# EAGLE design Mini_VFD_UI_RevA (EAGLE 9.6.2)
AUTH_NAME: MNa; REV_NO: A
Assembly variants: Assembly_1

## Sheet 1 of 3: Concept
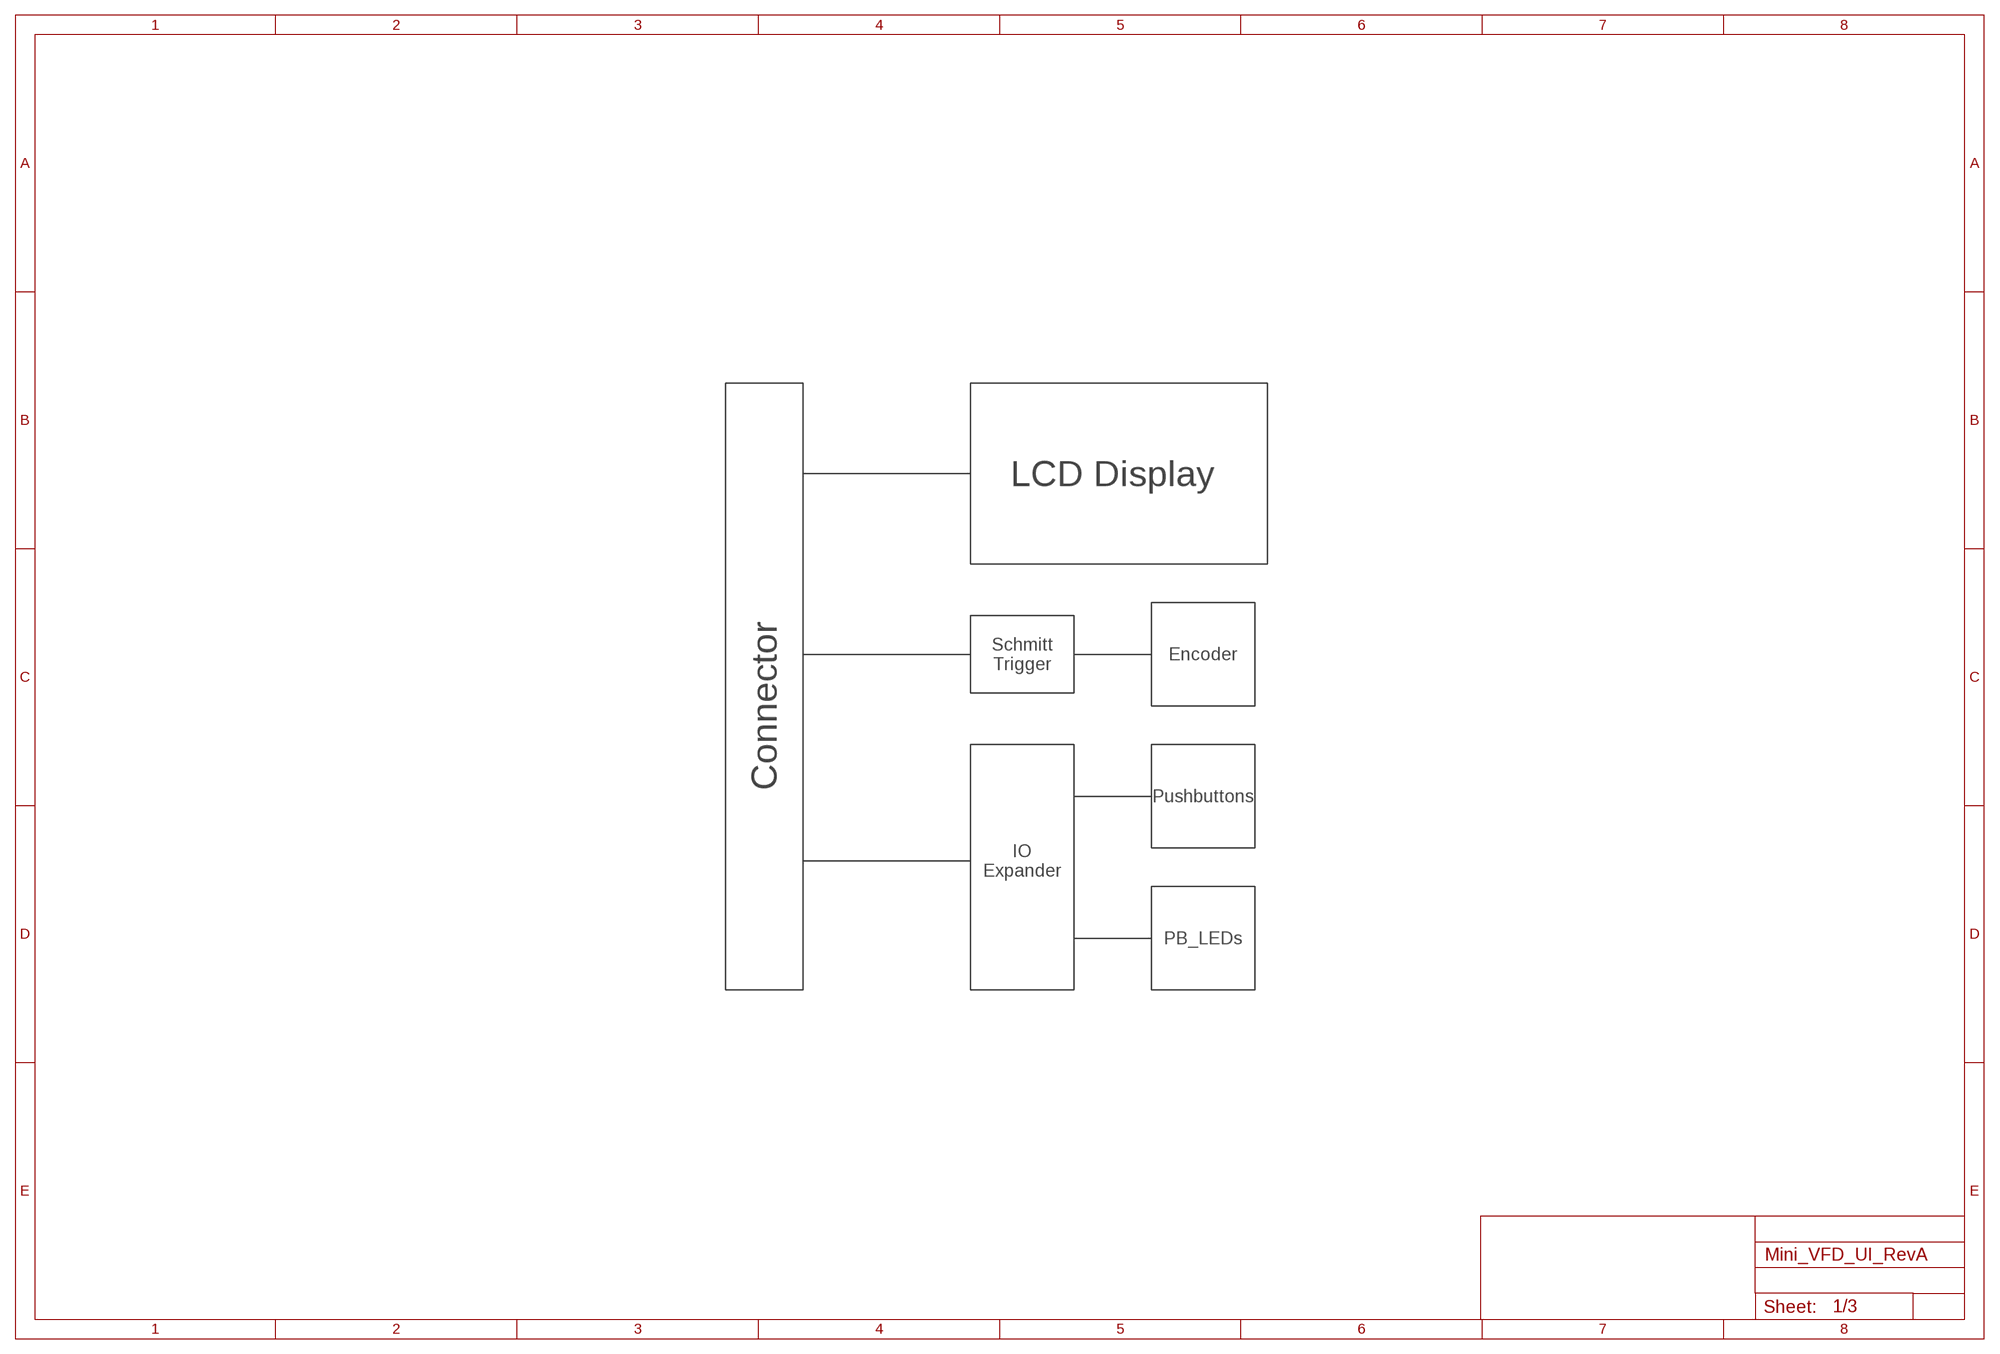
[diagram p0: schematic, sheet 1]

### Notes on the sheet
- LCD Display
- Schmitt
  Trigger
- Encoder
- Connector
- Pushbuttons
- IO
  Expander
- PB_LEDs

## Sheet 2 of 3: Processor
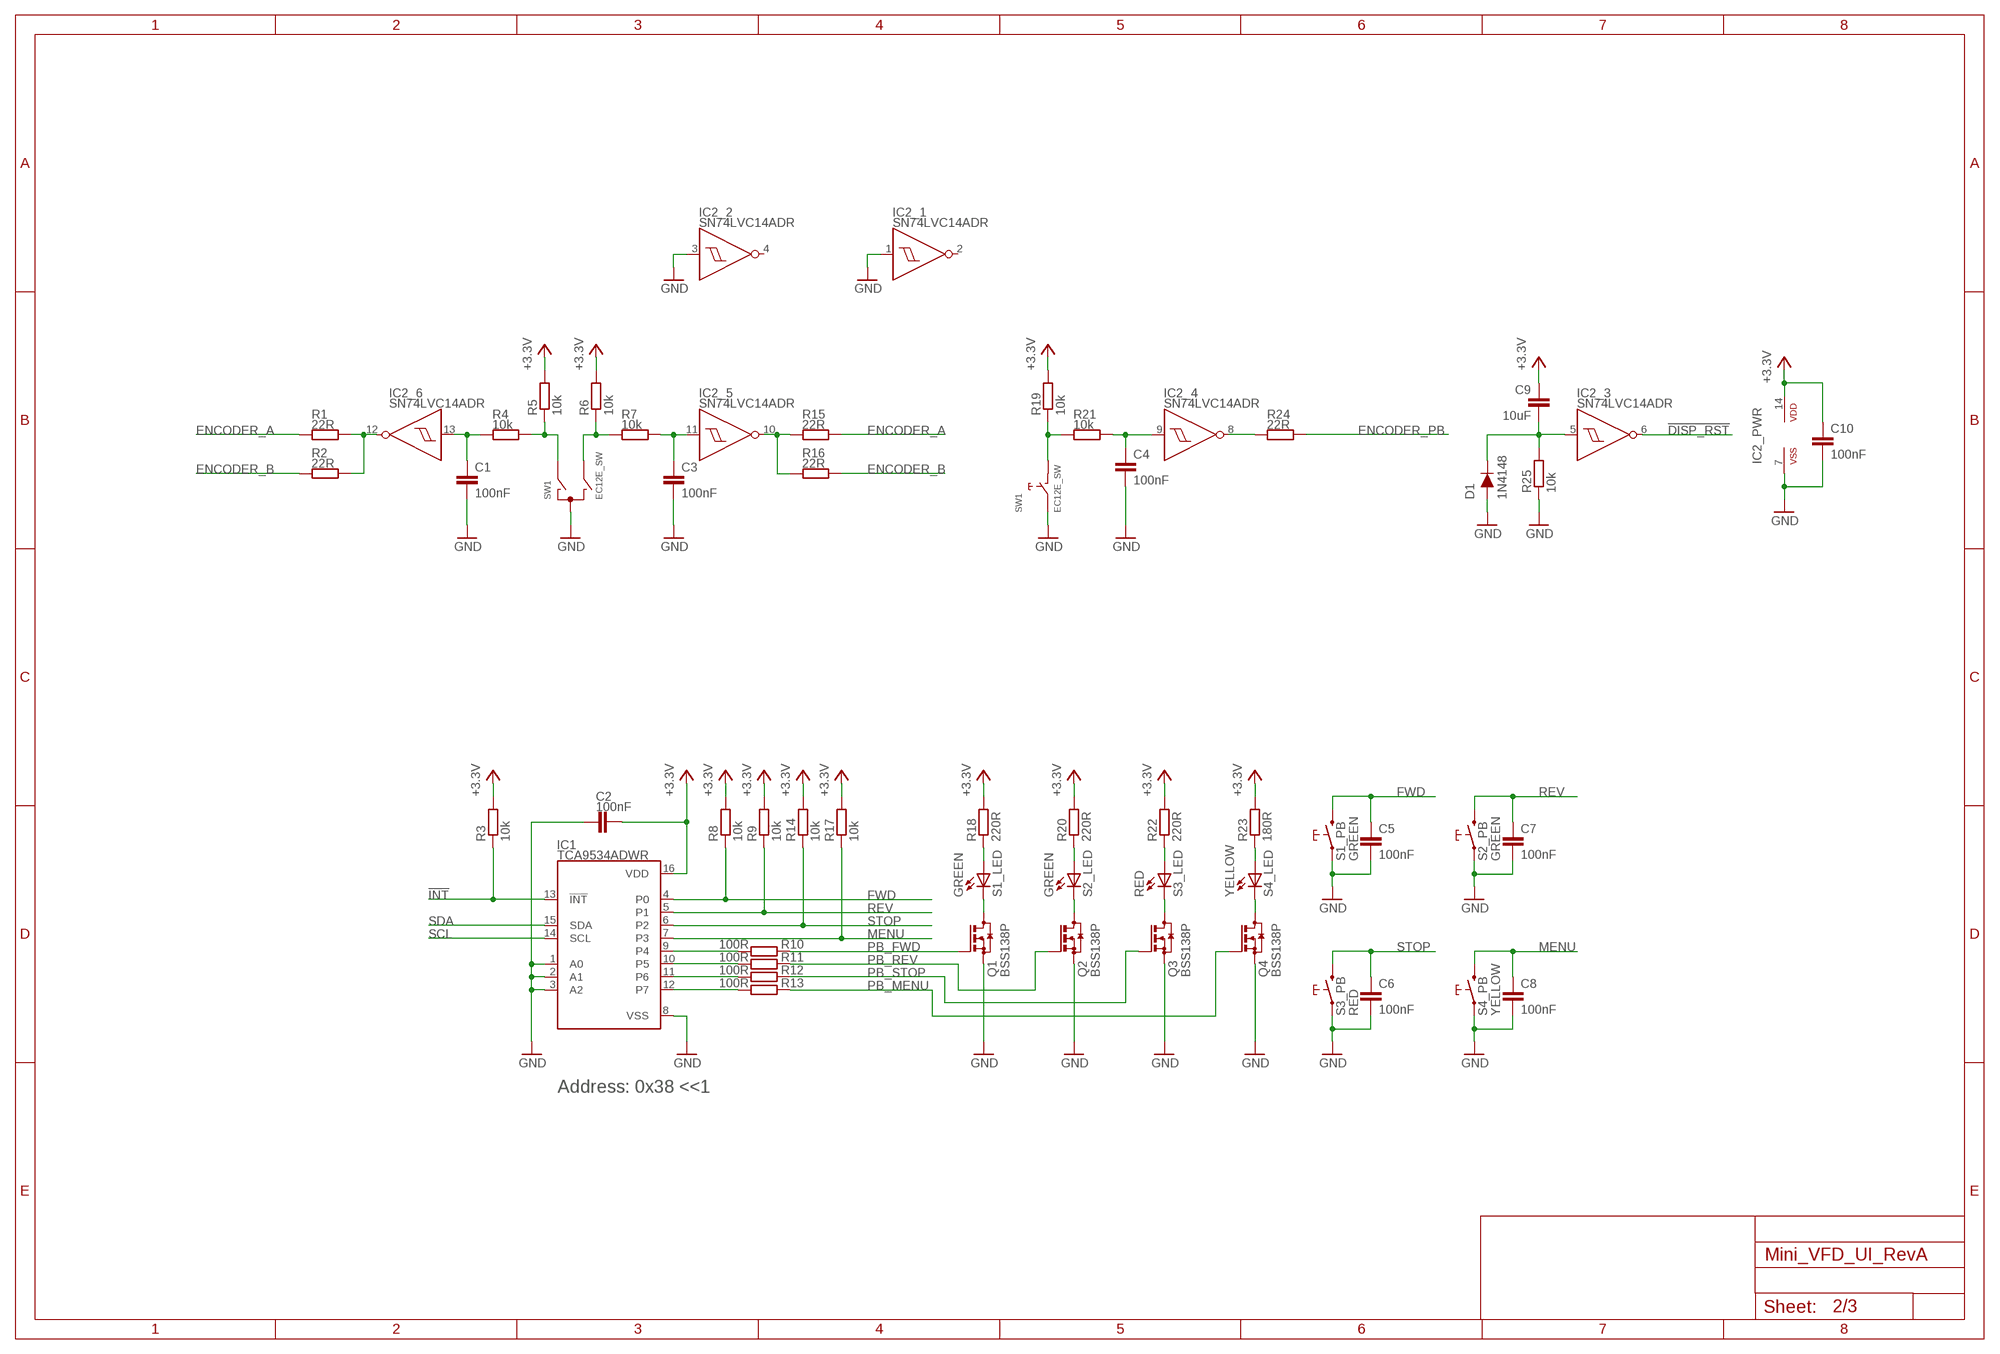
[diagram p1: schematic, sheet 2]

### Parts
C1  100nF  C-EUC0603  [C0603]
C2  100nF  C-EUC0603  [C0603]
C3  100nF  C-EUC0603  [C0603]
C4  100nF  C-EUC0603  [C0603]
C5  100nF  C-EUC0603  [C0603]
C6  100nF  C-EUC0603  [C0603]
C7  100nF  C-EUC0603  [C0603]
C8  100nF  C-EUC0603  [C0603]
C9  10uF  C-EUC1206  [C1206]
C10  100nF  C-EUC0603  [C0603]
D1  1N4148  DIODE  [SOD123]
IC1  TCA9534ADWR  TCA9534APWR_SOIC  [SOIC16R]
IC2  SN74LVC14ADR  SN74AC14PWR_SOIC  [SO14]
Q1  BSS138P  NMOS_BSS138P  [SOT23]
Q2  BSS138P  NMOS_BSS138P  [SOT23]
Q3  BSS138P  NMOS_BSS138P  [SOT23]
Q4  BSS138P  NMOS_BSS138P  [SOT23]
R1  22R  R-EU_R0603  [R0603]  (not fitted in variant Assembly_1)
R2  22R  R-EU_R0603  [R0603]
R3  10k  R-EU_R0603  [R0603]
R4  10k  R-EU_R0603  [R0603]
R5  10k  R-EU_R0603  [R0603]
R6  10k  R-EU_R0603  [R0603]
R7  10k  R-EU_R0603  [R0603]
R8  10k  R-EU_R0603  [R0603]
R9  10k  R-EU_R0603  [R0603]
R10  100R  R-EU_R0603  [R0603]
R11  100R  R-EU_R0603  [R0603]
R12  100R  R-EU_R0603  [R0603]
R13  100R  R-EU_R0603  [R0603]
R14  10k  R-EU_R0603  [R0603]
R15  22R  R-EU_R0603  [R0603]
R16  22R  R-EU_R0603  [R0603]  (not fitted in variant Assembly_1)
R17  10k  R-EU_R0603  [R0603]
R18  220R  R-EU_R0603  [R0603]
R19  10k  R-EU_R0603  [R0603]
R20  220R  R-EU_R0603  [R0603]
R21  10k  R-EU_R0603  [R0603]
R22  220R  R-EU_R0603  [R0603]
R23  180R  R-EU_R0603  [R0603]
R24  22R  R-EU_R0603  [R0603]
R25  10k  R-EU_R0603  [R0603]
S1  GREEN  PUSHBUTTON  [PB_ALIEXPRESS]
S2  GREEN  PUSHBUTTON  [PB_ALIEXPRESS]
S3  RED  PUSHBUTTON  [PB_ALIEXPRESS]
S4  YELLOW  PUSHBUTTON  [PB_ALIEXPRESS]
SW1  EC12E_SW  [ALPS_EC12E_SW]

### Nets
!DISP_RST: IC2.6(_3:O) ; also sheet 3
!INT: IC1.13(!INT) R3.1 ; also sheet 3
+3.3V: C2.2 C9.1 C10.1 IC1.16(VDD) IC2.14(_PWR:VDD) R3.2 R5.2 R6.2 R8.2 R9.2 R14.2 R17.2 R18.2 R19.2 R20.2 R22.2 R23.2 ; also sheet 3
ENCODER_A: R1.1 R15.2 ; also sheet 3
ENCODER_B: R2.1 R16.2 ; also sheet 3
ENCODER_PB: R24.2 ; also sheet 3
FWD: C5.1 IC1.4(P0) R8.1 S1.2A S1.2B
GND: C1.2 C2.1 C3.2 C4.2 C5.2 C6.2 C7.2 C8.2 C10.2 D1.2(A) IC1.1(A0) IC1.2(A1) IC1.3(A2) IC1.8(VSS) IC2.1(_1:I) IC2.3(_2:I) IC2.7(_PWR:VSS) Q1.2(S) Q2.2(S) Q3.2(S) Q4.2(S) R25.1 S1.1A S1.1B S2.1A S2.1B S3.1A S3.1B S4.1A S4.1B SW1.C SW1.E ; also sheet 3
MENU: C8.1 IC1.7(P3) R17.1 S4.2A S4.2B
N$1: R4.2 R5.1 SW1.A
N$2: R6.1 R7.1 SW1.B
N$3: C1.1 IC2.13(_6:I) R4.1
N$4: C3.1 IC2.11(_5:I) R7.2
N$5: R19.1 R21.1 SW1.D
N$6: C4.1 IC2.9(_4:I) R21.2
N$7: IC2.10(_5:O) R15.1 R16.1
N$8: IC2.12(_6:O) R1.2 R2.2
N$9: C9.2 D1.1(C) IC2.5(_3:I) R25.2
N$10: IC1.12(P7) R13.1
N$11: IC1.11(P6) R12.1
N$12: IC1.10(P5) R11.1
N$13: IC1.9(P4) R10.1
N$18: Q1.3(D) S1.-(_LED:C)
N$19: Q2.3(D) S2.-(_LED:C)
N$20: Q3.3(D) S3.-(_LED:C)
N$21: Q4.3(D) S4.-(_LED:C)
N$22: R18.1 S1.+(_LED:A)
N$23: R20.1 S2.+(_LED:A)
N$24: R22.1 S3.+(_LED:A)
N$25: R23.1 S4.+(_LED:A)
N$34: IC2.8(_4:O) R24.1
PB_FWD: Q1.1(G) R10.2
PB_MENU: Q4.1(G) R13.2
PB_REV: Q2.1(G) R11.2
PB_STOP: Q3.1(G) R12.2
REV: C7.1 IC1.5(P1) R9.1 S2.2A S2.2B
SCL: IC1.14(SCL) ; also sheet 3
SDA: IC1.15(SDA) ; also sheet 3
STOP: C6.1 IC1.6(P2) R14.1 S3.2A S3.2B
Unconnected: IC2.2(_1:O) IC2.4(_2:O) SW1.GND1(G) SW1.GND2(G1)

### Notes on the sheet
- Address: 0x38 <<1

## Sheet 3 of 3: MCU
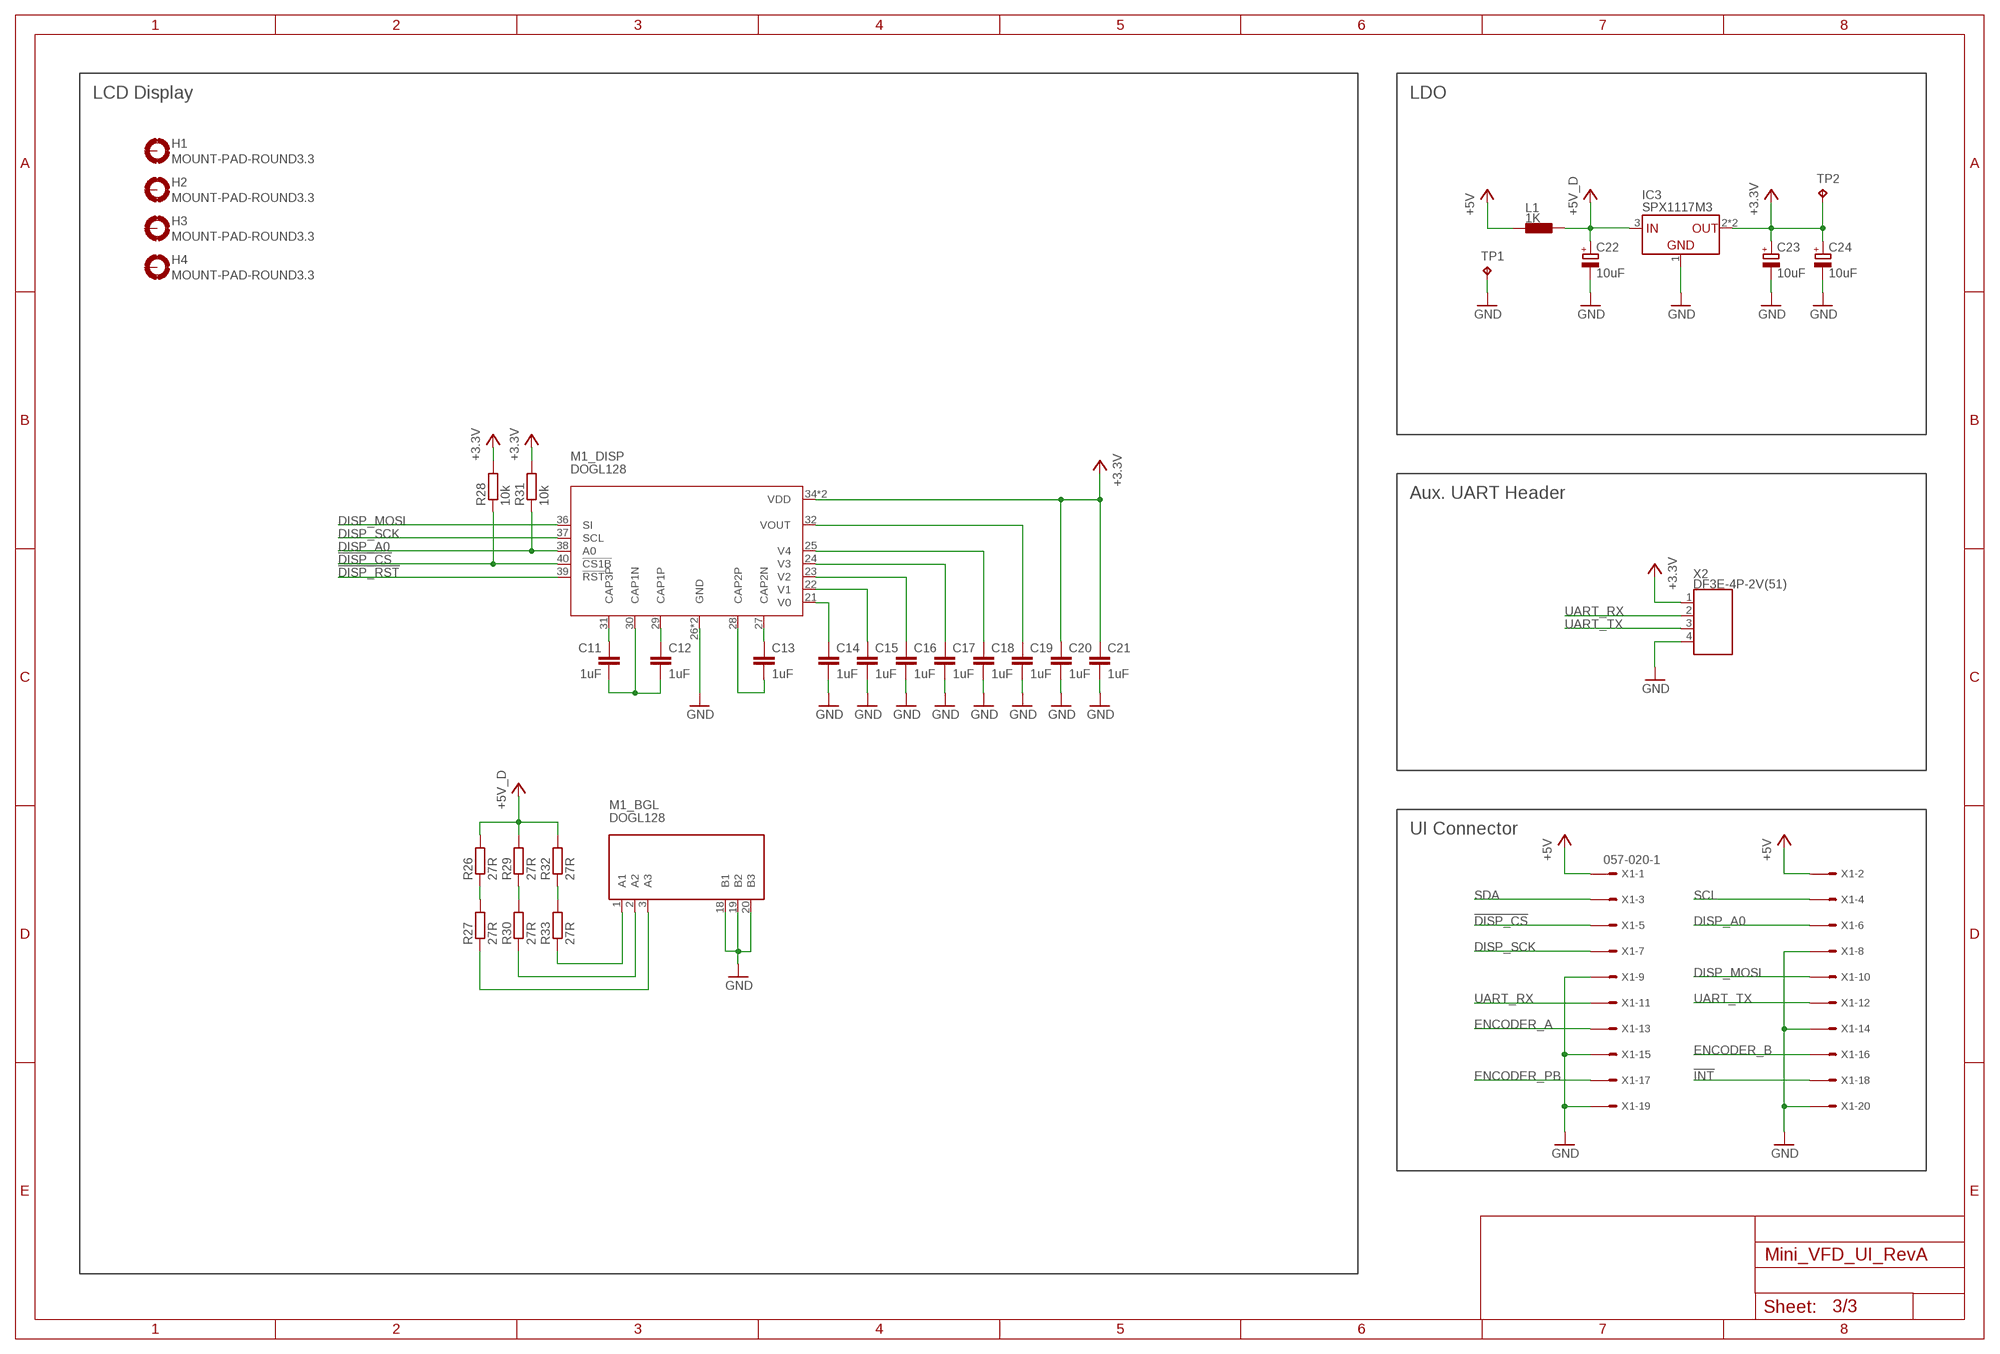
[diagram p2: schematic, sheet 3]

### Parts
C11  1uF  C-EUC0603  [C0603]
C12  1uF  C-EUC0603  [C0603]
C13  1uF  C-EUC0603  [C0603]
C14  1uF  C-EUC0603  [C0603]
C15  1uF  C-EUC0603  [C0603]
C16  1uF  C-EUC0603  [C0603]
C17  1uF  C-EUC0603  [C0603]
C18  1uF  C-EUC0603  [C0603]
C19  1uF  C-EUC0603  [C0603]
C20  1uF  C-EUC0603  [C0603]
C21  1uF  C-EUC0603  [C0603]
C22  10uF  CPOL-EUCT3528  [CT3528]
C23  10uF  CPOL-EUCT3528  [CT3528]
C24  10uF  CPOL-EUCT3528  [CT3528]
H1  MOUNT-PAD-ROUND3.3  [3,3-PAD]
H2  MOUNT-PAD-ROUND3.3  [3,3-PAD]
H3  MOUNT-PAD-ROUND3.3  [3,3-PAD]
H4  MOUNT-PAD-ROUND3.3  [3,3-PAD]
IC3  SPX1117M3  SPX1117_3V3  [SOT223]
L1  1K  BEAD0603  [R0603]
M1  DOGL128  [DOGL128-6]
R26  27R  R-EU_R1206  [R1206]
R27  27R  R-EU_R1206  [R1206]
R28  10k  R-EU_R0603  [R0603]
R29  27R  R-EU_R1206  [R1206]
R30  27R  R-EU_R1206  [R1206]
R31  10k  R-EU_R0603  [R0603]
R32  27R  R-EU_R1206  [R1206]
R33  27R  R-EU_R1206  [R1206]
TP1  TPTP10R  [TP10R]
TP2  TPTP10R  [TP10R]
X1  057-020-1  [057-020-1]
X2  DF3E-4P-2V(51)  DF3E-4P-2V  [DF3E-4P-2V]  (not fitted in variant Assembly_1)

### Nets
!DISP_CS: M1.40(_DISP:!CS1B) R28.1 X1.5
!DISP_RST: M1.39(_DISP:!RST) ; also sheet 2
!INT: X1.18 ; also sheet 2
+3.3V: C20.1 C21.1 C23.+ C24.+ IC3.2(VOUT) IC3.4(VOUT) M1.34(_DISP:VDD) M1.35(_DISP:VDD) R28.2 R31.2 TP2.TP X2.1 ; also sheet 2
+5V: L1.2 X1.1 X1.2
+5V_D: C22.+ IC3.3(VIN) L1.1 R26.2 R29.2 R32.2
DISP_A0: M1.38(_DISP:A0) R31.1 X1.6
DISP_MOSI: M1.36(_DISP:SI) X1.10
DISP_SCK: M1.37(_DISP:SCL) X1.7
ENCODER_A: X1.13 ; also sheet 2
ENCODER_B: X1.16 ; also sheet 2
ENCODER_PB: X1.17 ; also sheet 2
GND: C14.2 C15.2 C16.2 C17.2 C18.2 C19.2 C20.2 C21.2 C22.- C23.- C24.- IC3.1(GND) M1.18(_BGL:B1) M1.19(_BGL:B2) M1.20(_BGL:B3) M1.26(_DISP:GND) M1.33(_DISP:GND) TP1.TP X1.8 X1.9 X1.14 X1.15 X1.19 X1.20 X2.4 ; also sheet 2
N$14: C13.2 M1.28(_DISP:CAP2P)
N$15: C13.1 M1.27(_DISP:CAP2N)
N$16: C12.1 M1.29(_DISP:CAP1P)
N$17: C11.2 C12.2 M1.30(_DISP:CAP1N)
N$26: C11.1 M1.31(_DISP:CAP3P)
N$27: C14.1 M1.21(_DISP:V0)
N$28: C15.1 M1.22(_DISP:V1)
N$29: C16.1 M1.23(_DISP:V2)
N$30: C17.1 M1.24(_DISP:V3)
N$31: C18.1 M1.25(_DISP:V4)
N$32: C19.1 M1.32(_DISP:VOUT)
N$33: R26.1 R27.2
N$35: M1.3(_BGL:A3) R27.1
N$36: M1.2(_BGL:A2) R30.1
N$37: M1.1(_BGL:A1) R33.1
N$38: R29.1 R30.2
N$39: R32.1 R33.2
SCL: X1.4 ; also sheet 2
SDA: X1.3 ; also sheet 2
UART_RX: X1.11 X2.2
UART_TX: X1.12 X2.3
Unconnected: H1.B3,3(MOUNT) H2.B3,3(MOUNT) H3.B3,3(MOUNT) H4.B3,3(MOUNT)

### Notes on the sheet
- LCD Display | LDO
- Aux. UART Header
- UI Connector

## Library data of the parts
C1-C21 = rcl_MICHAEL:C-EU: CAPACITOR, European symbol; SPICEPREFIX: C
C22-C24 = rcl_MICHAEL:CPOL-EU: POLARIZED CAPACITOR, European symbol; SPICEPREFIX: C
D1 = lib_CASE_STUDY19:DIODE: Diodes
H1-H4 = holes:MOUNT-PAD-ROUND: MOUNTING PAD, round
IC1 = lib_CASE_STUDY19:TCA9534APWR: 8 I²C 400kHz TSSOP-16 Interface - I/O Expanders RoHS; OC: 296-49932-1-ND; SUPPLIER: Digikey
IC2 = lib_CASE_STUDY19:SN74AC14PWR: IC INVERTER SCHMITT 6CH; OC: C133541; SUPPLIER: LCSC
IC3 = lib_CASE_STUDY19:SPX1117: IC REG LINEAR 3.3V 800MA SOT223; OC: 1016-1848-1-ND; SUPPLIER: Digikey
L1 = rcl_MICHAEL:BEAD: Ferrite Bead
M1 = lib_CASE_STUDY19:DOGL128: DOGL128 DISPLAY 128 X 64
Q1-Q4 = lib_CASE_STUDY19:NMOS: NMOS General purpose; OC: C75547; SUPPLIER: LCSC
R1-R33 = rcl_MICHAEL:R-EU_: RESISTOR, European symbol; SPICEPREFIX: R
S1-S4 = lib_CASE_STUDY19:PUSHBUTTON
SW1 = lib_CASE_STUDY19:EC12E_SW: ALPS rotary Encoder EC12E series with switch; MPN: EC12E2424407; OC_FARNELL: 1520813; OC_NEWARK: 74M1068
TP1 TP2 = lib_CASE_STUDY19:TP: Test pad
X1 = con-panduit:057-020-: CONNECTOR 20-pin series 057 contact pc board low profile headers; OC_FARNELL: unknown; OC_NEWARK: unknown
X2 = Connectors:DF3E-4P-2V: CONN HEADER SMD 4POS 2MM; OC: H125417CT-ND; SUPPLIER: Digikey

## Net classes
0 default: width 0.15 mm, drill 0.2 mm, clearance 0.2 mm
1 High_Voltage: width 0.2 mm, drill 0.2 mm, clearance 2.5 mm to class 0, clearance 2.5 mm

## Board
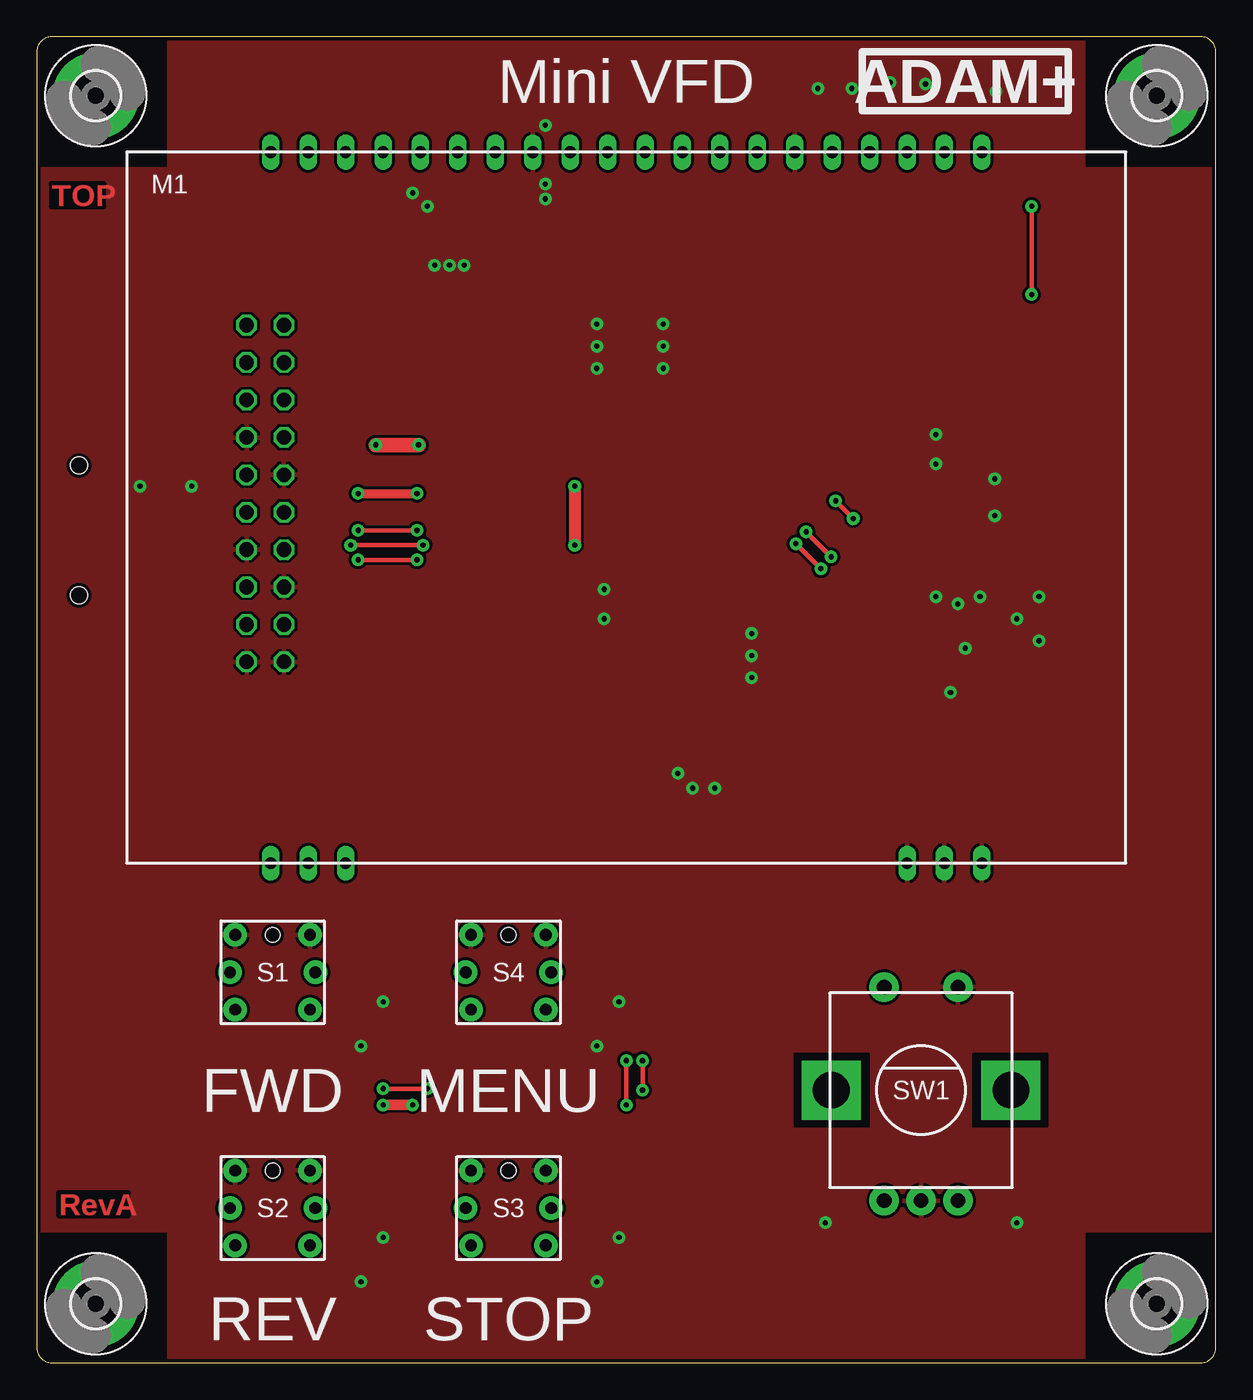
[diagram p3: board, top side]
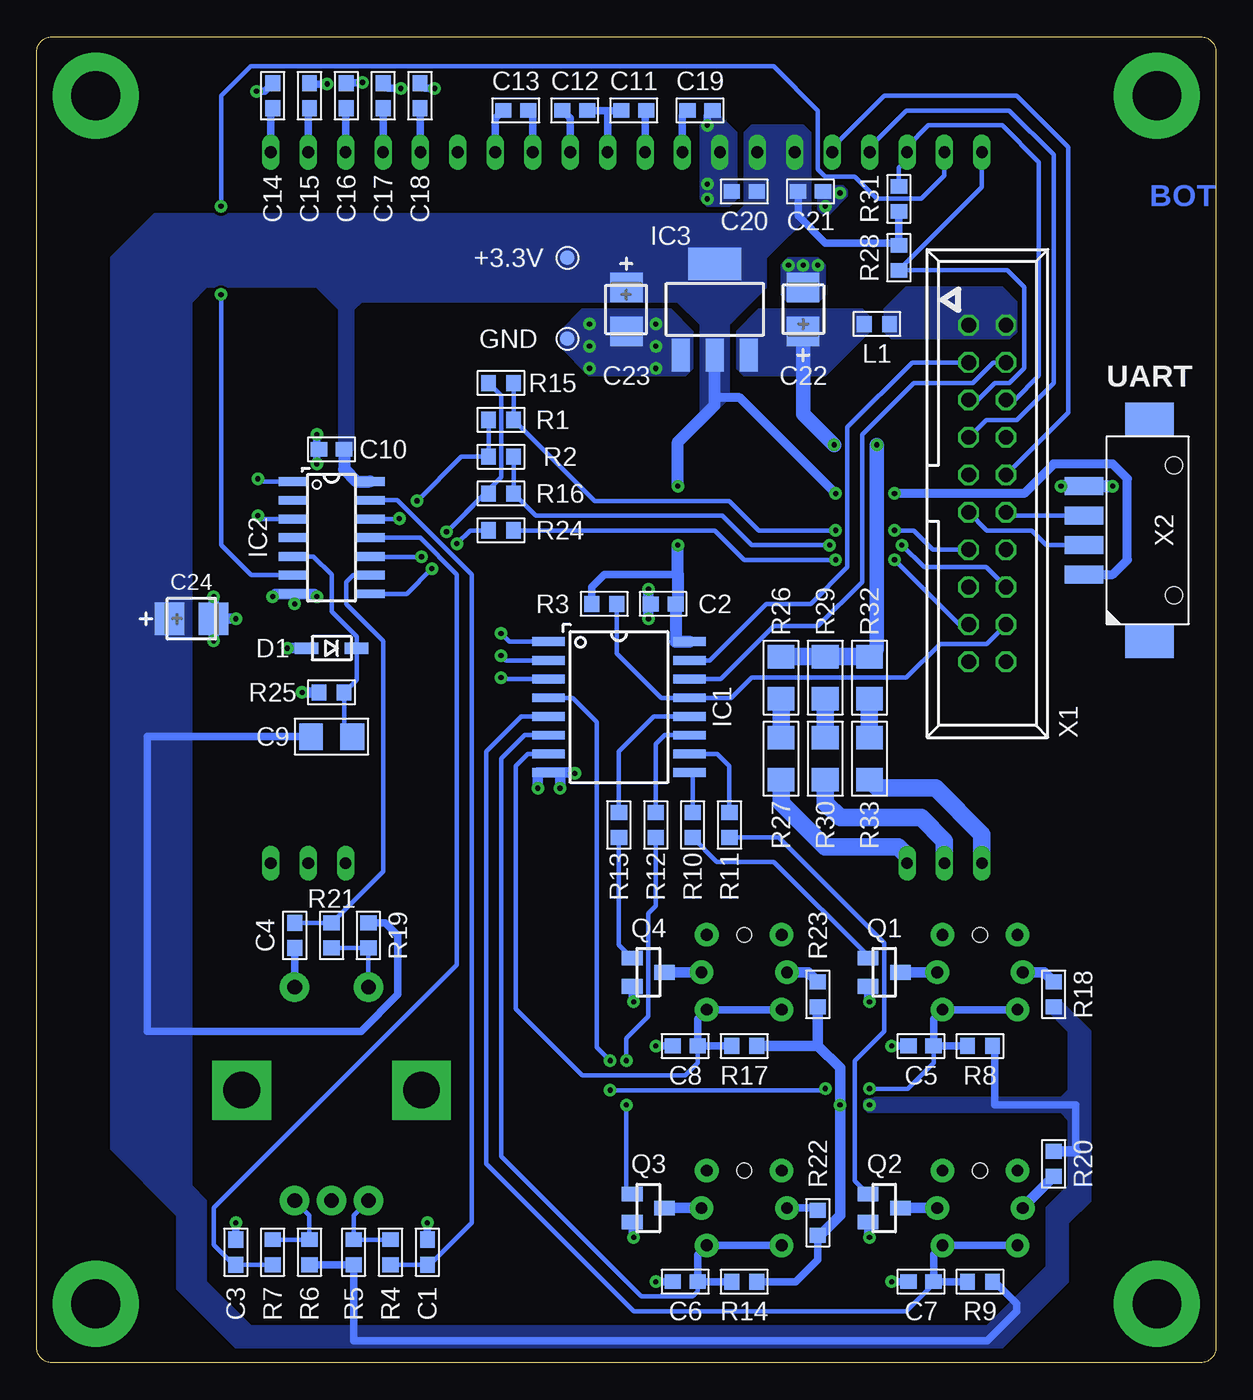
[diagram p4: board, bottom side, seen from below]

Size 80 x 90 mm. Coordinates in mm from the lower left corner, seen from the top.
Outline: 0,1 arc90 1,0 79,0 arc90 80,1 80,89 arc90 79,90 1,90 arc90 0,89 0,1
Copper layers (1*16): Top 0.035mm / dielectric 1.5mm / Bottom 0.035mm
Design rules "PCB-POOL Standard *": minimum track width 0.2mm, minimum drill 0.3mm, track to track 0.2mm, track to pad 0.2mm, pad to pad 0.2mm, via to via 0.2mm, smd to smd 0.2mm, copper to edge 0.25mm, drill to drill 0.2mm, minimum pad ring 0.2mm, minimum via ring 0.25mm, stop-mask expansion 0.03mm, vias tented up to drill 13mm, thermal gap 0.2mm

### Footprints (pad centres in the part's own frame; a part is rotated, then mirrored left to right if it is on the bottom)
C0603 = smd 1.1 x 1: 1 -0.85,0; 2 0.85,0
C1206 = smd 1.6 x 1.8: 1 -1.4,0; 2 1.4,0
CT3528 = smd 2 x 2.2: + -1.5,0; - 1.5,0
SOD123 = smd 1.6 x 0.8: 1 -1.7,0; 2 1.7,0
3,3-PAD = drill 3.3 pad 5.842: B3,3 0,0
SOIC16R = smd 0.6 x 2.2: 1 -4.445,-4.775; 2 -3.175,-4.775; 3 -1.905,-4.775; 4 -0.635,-4.775; 5 0.635,-4.775; 6 1.905,-4.775; 7 3.175,-4.775; 8 4.445,-4.775; 9 4.445,4.8; 10 3.175,4.8; 11 1.905,4.8; 12 0.635,4.8; 13 -0.635,4.8; 14 -1.905,4.8; 15 -3.175,4.8; 16 -4.445,4.8
SO14 = smd 0.6 x 2: 1 -3.81,-2.6; 2 -2.54,-2.6; 3 -1.27,-2.6; 4 0,-2.6; 5 1.27,-2.6; 6 2.54,-2.6; 7 3.81,-2.6; 8 3.81,2.6; 9 2.54,2.6; 10 1.27,2.6; 11 0,2.6; 12 -1.27,2.6; 13 -2.54,2.6; 14 -3.81,2.6
SOT223 = smd 1.219 x 2.235: 1 -2.311,-3.099; 2 0,-3.099; 3 2.311,-3.099 | smd 3.6 x 2.2: 4 0,3.099
R0603 = smd 1 x 1.1: 1 -0.85,0; 2 0.85,0
DOGL128-6 = drill 0.8 long: 1 -24.13,-21.59; 2 -21.59,-21.59; 3 -19.05,-21.59; 18 19.05,-21.59; 19 21.59,-21.59; 20 24.13,-21.59; 21 24.13,26.67; 22 21.59,26.67; 23 19.05,26.67; 24 16.51,26.67; 25 13.97,26.67; 26 11.43,26.67; 27 8.89,26.67; 28 6.35,26.67; 29 3.81,26.67; 30 1.27,26.67; 31 -1.27,26.67; 32 -3.81,26.67; 33 -6.35,26.67; 34 -8.89,26.67; 35 -11.43,26.67; 36 -13.97,26.67; 37 -16.51,26.67; 38 -19.05,26.67; 39 -21.59,26.67; 40 -24.13,26.67
SOT23 = smd 1 x 1.4: 1 -0.95,-1.1; 2 0.95,-1.1; 3 0,1.1
R1206 = smd 1.6 x 1.803: 1 -1.422,0; 2 1.422,0
PB_ALIEXPRESS = drill 0.8 pad 1.6: 1A -2.54,2.54; 1B 2.54,2.54; 2A -2.54,-2.54; 2B 2.54,-2.54; + -2.9,0; - 2.9,0 | hole 1: 0,2.54
ALPS_EC12E_SW = drill 1 pad 2: A -2.5,-7.5; B 2.5,-7.5; C 0,-7.5; D -2.5,7; E 2.5,7 | drill 2.5 pad 4 square: GND1 -6.1,0; GND2 6.1,0
TP10R = smd 1 x 1: TP 0,0
057-020-1 = drill 1 octagon: 1 -11.43,-1.27; 2 -11.43,1.27; 3 -8.89,-1.27; 4 -8.89,1.27; 5 -6.35,-1.27; 6 -6.35,1.27; 7 -3.81,-1.27; 8 -3.81,1.27; 9 -1.27,-1.27; 10 -1.27,1.27; 11 1.27,-1.27; 12 1.27,1.27; 13 3.81,-1.27; 14 3.81,1.27; 15 6.35,-1.27; 16 6.35,1.27; 17 8.89,-1.27; 18 8.89,1.27; 19 11.43,-1.27; 20 11.43,1.27
DF3E-4P-2V = smd 1.2 x 2.6: 1 3,-4.45; 2 1,-4.45; 3 -1,-4.45; 4 -3,-4.45 | smd 2.3 x 3.3: P$1 -7.52,0; P$2 7.52,0 | hole 1.15: -4.4,1.65; 4.4,1.65

### Placement (x,y rotation side)
C1  53.5,7.5 90 bottom
C2  37.5,51.5 0 bottom
C3  66.5,7.5 90 bottom
C4  62.5,29 270 bottom
C5  20,21.5 180 bottom
C6  36,5.5 180 bottom
C7  20,5.5 180 bottom
C8  36,21.5 180 bottom
C9  60,42.5 0 bottom
C10  60,62 180 bottom
C11  39.5,85 180 bottom
C12  43.5,85 0 bottom
C13  47.5,85 0 bottom
C14  64,86 90 bottom
C15  61.5,86 90 bottom
C16  59,86 90 bottom
C17  56.5,86 90 bottom
C18  54,86 90 bottom
C19  35,85 0 bottom
C20  32,79.5 180 bottom
C21  27.5,79.5 0 bottom
C22  28,71.5 90 bottom
C23  40,71.5 270 bottom
C24  69.5,50.5 0 bottom
D1  60,48.5 180 bottom
H1  4,4 0 top
H2  76,4 0 top
H3  4,86 0 top
H4  76,86 0 top
IC1  40.5,44.5 270 bottom
IC2  60,56 270 bottom
IC3  34,71.5 0 bottom
L1  23,70.5 0 bottom
M1  40,55.5 0 top
Q1  22.5,26.5 270 bottom
Q2  22.5,10.5 270 bottom
Q3  38.5,10.5 270 bottom
Q4  38.5,26.5 270 bottom
R1  48.5,64 180 bottom  (not fitted)
R2  48.5,61.5 180 bottom
R3  41.5,51.5 180 bottom
R4  56,7.5 90 bottom
R5  58.5,7.5 270 bottom
R6  61.5,7.5 270 bottom
R7  64,7.5 270 bottom
R8  16,21.5 0 bottom
R9  16,5.5 0 bottom
R10  35.5,36.5 270 bottom
R11  33,36.5 270 bottom
R12  38,36.5 270 bottom
R13  40.5,36.5 270 bottom
R14  32,5.5 0 bottom
R15  48.5,66.5 0 bottom
R16  48.5,59 0 bottom  (not fitted)
R17  32,21.5 0 bottom
R18  11,25 270 bottom
R19  57.5,29 90 bottom
R20  11,13.5 90 bottom
R21  60,29 90 bottom
R22  27,9.5 270 bottom
R23  27,25 270 bottom
R24  48.5,56.5 0 bottom
R25  60,45.5 0 bottom
R26  29.5,46.5 90 bottom
R27  29.5,41 90 bottom
R28  21.5,75 90 bottom
R29  26.5,46.5 90 bottom
R30  26.5,41 90 bottom
R31  21.5,79 270 bottom
R32  23.5,46.5 90 bottom
R33  23.5,41 90 bottom
S1  16,26.5 0 top
S2  16,10.5 0 top
S3  32,10.5 0 top
S4  32,26.5 0 top
SW1  60,18.5 0 top
TP1  44,69.5 0 bottom
TP2  44,75 0 bottom
X1  15.5,59 270 bottom
X2  4.5,56.5 270 bottom  (not fitted)

### Tracks (layer width: path | path; a pad name or v marks a point on that pad's centre or on a via)
!DISP_CS
  Bottom 0.3: X1.5 16.15,65.35 15,66.5 14,66.5 13,67.5 13,73 14.15,74.15 R28.1 15.87,79.78 M1.40
!DISP_RST  (via drill 0.35)
  Top 0.3: v67.5,78.5 v67.5,72.5
  Bottom 0.3: M1.39 18.41,80.59 20,79 23,79 24.5,80.5 26.5,80.5 27,81 27,85 30,88 65.5,88 67.5,86 v67.5,78.5 | v67.5,72.5 67.5,55.5 65.46,53.46 IC2.6
!INT
  Bottom 0.3: X1.18 15.54,48.8 18.7,48.8 21,46.5 31.5,46.5 32.87,45.13 IC1.13 37.63,45.13 40.65,48.15 R3.1
+3.3V  (via drill 0.35)
  Top 0.6: v21.8,59 v25.8,59
  Top 0.7: v25.5,17.5 v23.5,17.5
  Top 0.8: v36.5,59.5 v36.5,55.5
  Bottom 0.5: R6.2 R5.2 58.5,1.5 15.5,1.5 13.5,3.5 13.5,4 15,5.5 R9.2 | R22.2 27,7 28.5,5.5 R14.2 | 9.5,14.35 9.5,17.5 15,17.5 15,21.35 R8.2 | R19.2 56.35,29.85 55.5,29 55.5,25 58,22.5 72.5,22.5 72.5,42.5 C9.1 | R3.2 42.35,52.65 41.5,53.5 36.5,53.5 | C21.1 28.35,77.85 26.5,76 21.65,76 | 21.65,76 21.5,76 R31.2 | 21.65,76 R28.2
  Bottom 0.6: X2.1 7,53.5 6,54.5 6,60 7,61 11,61 13,59 v21.8,59 | v25.8,59 32.3,65.5 34,65.5
  Bottom 0.7: R17.2 27,21.5 | 27,21.5 R23.2 | R22.2 26.85,8.65 25.5,10 v25.5,17.5 25.5,20 27,21.5 | R20.2 9.5,14.35
  Bottom 0.8: IC1.16 36.65,48.95 C2.2 36.5,51.65 36.5,53.5 v36.5,55.5 | v36.5,59.5 36.5,62.5 34,65 34,65.5 IC3.2 | C10.1 59.15,60.65 58.31,59.81 IC2.14
  pour Bottom (no thermals): 30.5,75 30.5,73 33,70.5 33,65.5 35,63.5 35,70.5 36.5,72 58,72 58.5,71.5 58.5,62 59,61.5 59.5,61.5 59.5,71.5 61,73 68.5,73 69.5,72 69.5,12 68.5,11 68.5,5.5 65.5,2.5 15.5,2.5 11.5,6.5 11.5,10.5 10,12 10,16.5 10.5,17 23.6,17 23.9,17.3 23.9,17.7 23.6,18 10.5,18 10,18.5 10,22.5 11.5,24 11.5,24.5 10.5,24.5 8.5,22.5 8.5,11 10,9.5 10,5.5 14.5,1 66.5,1 70.5,5 70.5,10 75,14.5 75,75 72,78 32.5,78 32,78.5 32,83.5 31.5,84 28,84 27.5,83.5 27.5,78
+5V
  pour Bottom (no thermals): 21,73 14.5,73 13.5,72 13.5,70 14,69.5 22,69.5 22.5,70 22.5,71.5
+5V_D  (via drill 0.35)
  Top 1: v25.9,62.3 v23,62.3
  Bottom 1: C22.+ 28,64.4 v25.9,62.3 | R32.2 23,48.42 v23,62.3
  Bottom 1.2: R32.2 R29.2 R26.2
  pour Bottom (no thermals): 31,71.5 24,71.5 23.5,71 23.5,70 26.5,67 32,67 32.5,67.5 32.5,70
DISP_A0
  Bottom 0.3: X1.6 13.65,65.35 12,67 12,81.5 14.5,84 19.5,84 20.95,82.55 M1.38 20.95,81.67 21.5,81.12 R31.1
DISP_MOSI
  Bottom 0.3: M1.36 26.03,82.47 22.5,86 13.5,86 10,82.5 10,64.5 X1.10
DISP_SCK
  Bottom 0.3: M1.37 23.49,82.51 21,85 14,85 11,82 11,66.5 13.5,64 15.58,64 X1.7
ENCODER_A  (via drill 0.35)
  Top 0.3: v25.8,56.5 v21.8,56.5
  Bottom 0.3: X1.13 19.19,55.19 20.5,56.5 v21.8,56.5 | v25.8,56.5 31,56.5 33,58.5 42.15,58.5 R1.1 R15.2
ENCODER_B  (via drill 0.35)
  Top 0.3: v26.2,55.5 v21.3,55.5
  Bottom 0.3: X1.16 15.58,54 19.8,54 v21.3,55.5 | v26.2,55.5 31.5,55.5 33.5,57.5 46.15,57.5 R16.2 R2.1
ENCODER_PB  (via drill 0.35)
  Top 0.3: v21.8,54.5 v25.8,54.5
  Bottom 0.3: X1.17 17.41,50.11 v21.8,54.5 | v25.8,54.5 32,54.5 34,56.5 R24.2
FWD  (via drill 0.35)
  Top 0.3: v26.5,18.6 v23.5,18.6 | v41.1,20.5 v41.1,18.5
  Bottom 0.3: C5.1 19.15,20.35 20.9,18.6 v23.5,18.6 | v41.1,18.5 26.6,18.5 v26.5,18.6 | v41.1,20.5 42,21.4 42,43.5 43.63,45.13 IC1.4
  Bottom 0.5: S1.2A S1.2B 19.15,23.35 C5.1 R8.1
GND  (via drill 0.35)
  Bottom 0.3: IC1.3 48.41,46.41 v48.5,46.5 | IC1.2 48.17,47.67 v48.5,48 | IC1.1 47.95,48.95 v48.5,49.5 | IC2.1 64.81,59.81 v65,60 | IC2.3 64.77,57.27 v65,57.5
  Bottom 0.5: C18.2 53.65,86.5 v53,86.5 | C17.2 56.15,86.5 v55.3,86.5 | C16.2 58.95,86.9 v57.9,86.9 | C15.2 61.45,86.8 v60.3,86.8 | v65.1,86.3 64.55,86.3 C14.2 | C19.2 34.5,84.65 v34.5,84 | C3.2 v66.5,9.5 | C1.2 v53.5,9.5 | SW1.E C4.2 | v38,21.5 C8.2 | v22,21.5 C5.2 | v22,5.5 C7.2 | v38,5.5 C6.2 | 43.55,40.05 v43.5,40 | IC1.8 44.5,40.05 | v61,63 61,62.15 C10.2 61,61.85 v61,61 | IC2.7 62.5,52.09
  Bottom 0.7: Q3.2 39.5,9.45 v39.5,8.5 | Q2.2 23.5,9.45 v23.5,8.5 | Q1.2 23.5,25.45 v23.5,24.5 | Q4.2 39.5,25.45 v39.5,24.5 | 43.55,40.05 IC1.8 46,40.05 v46,39 | 44.5,40.05 v44.5,39 | v38.5,52.5 38.5,51.65 C2.1 38.5,51.35 v38.5,50.5 | v61,52 61.19,52.19 IC2.7 63.81,52.19 v64,52 | 62.5,52.09 v62.5,51.5 | D1.2 v63,48.5 | R25.1 v62,45.5 | C24.- v68,52 | C24.- v66.5,50.5 | C24.- v68,49
  Bottom 0.8: v10.5,59.5 X2.4 v7,59.5
  other vias: 29,74.5 28,74.5 27,74.5 38,70.5 38,69 38,67.5 42.5,67.5 42.5,69 42.5,70.5 25.5,79.4 26.5,78.5 34.5,79 34.5,80
  pour Bottom (no thermals): 43,71.5 37,71.5 35.5,70 35.5,67.5 36,67 42.5,67 44.5,69 44.5,70
  pour Bottom (no thermals): 26.5,74.5 26.5,72.5 27,72 29,72 29.5,72.5 29.5,74.5 29,75 27,75
  pour Bottom (no thermals): 34,85 32.5,83.5 32.5,79 33,78.5 34.5,78.5 35,79 35,84
  pour Bottom (no thermals): 25,79.6 25,79.2 26.2,78 26.7,78 27,78.3 27,79.9 25.3,79.9
  pour Top: 9,90.5 71,90.5 71,81 80.5,81 80.5,9 71,9 71,-0.5 9,-0.5 9,9 -0.5,9 -0.5,81 9,81
  cutout Top: 51.4,21 56.5,21 56.5,16 51.4,16
  cutout Top: 63.5,21 68.6,21 68.6,16 63.5,16
MENU
  Bottom 0.3: C8.1 35.15,20.35 36,19.5 43,19.5 47.5,24 47.5,40.5 46.67,41.33 IC1.7
  Bottom 0.5: S4.2A S4.2B 35.15,23.35 C8.1 R17.1
N$1
  Bottom 0.3: SW1.A 58.5,10 R5.1 R4.2
N$2
  Bottom 0.3: R7.1 R6.1 61.5,10 SW1.B
N$3
  Bottom 0.3: R4.1 C1.1 53.35,6.65 50.5,9.5 50.5,53.5 55.54,58.54 IC2.13
N$4
  Bottom 0.3: R7.2 C3.1 66.65,6.65 68,8 68,10.5 51.5,27 51.5,53.5 54,56 IC2.11
N$5
  Bottom 0.3: SW1.D R19.1 R21.1
N$6
  Bottom 0.3: C4.1 R21.2 56.5,33.35 56.5,49 59,51.5 59,53 58.54,53.46 IC2.9
N$7  (via drill 0.35)
  Top 0.3: v53.9,54.7 v52.2,56.4
  Bottom 0.3: R15.1 48.5,65.65 48.5,60.1 v52.2,56.4 49.6,59 R16.1 | IC2.10 57.37,54.7 v53.9,54.7
N$8  (via drill 0.35)
  Top 0.3: v55.4,57.3 v54.2,58.5
  Bottom 0.3: R1.2 R2.2 51.2,61.5 v54.2,58.5 | IC2.12 55.43,57.27 v55.4,57.3
N$9
  Bottom 0.3: C9.2 59.15,43.05 R25.2 58.3,46.35 D1.1 58.3,49.3 60,51 60,53.5 61.23,54.73 IC2.5
N$10
  Bottom 0.3: R13.1 40.5,41.5 38.13,43.87 IC1.12
N$11
  Bottom 0.3: IC1.11 37.41,42.59 38,42 R12.1
N$12
  Bottom 0.3: IC1.10 33.83,41.33 33,40.5 R11.1
N$13
  Bottom 0.3: IC1.9 35.5,39.85 R10.1
N$14
  Bottom 0.5: M1.28 46.35,84.7 C13.2
N$15
  Bottom 0.5: M1.27 48.89,84.46 C13.1
N$16
  Bottom 0.5: M1.29 43.81,84.46 C12.1
N$17
  Bottom 0.5: C12.2 41.5,85 41.27,85 | 41.27,85 C11.2 | M1.30 41.27,85
N$18
  Bottom 0.7: Q1.3 S1.-
N$19
  Bottom 0.7: Q2.3 S2.-
N$20
  Bottom 0.7: Q3.3 S3.-
N$21
  Bottom 0.7: Q4.3 S4.-
N$22
  Bottom 0.7: S1.+ 11.65,26.5 R18.1
N$23
  Bottom 0.5: S2.+ 13.1,10.55
  Bottom 0.7: 13.1,10.55 R20.1
N$24
  Bottom 0.5: R22.1 27.15,10.5 S3.+
N$25
  Bottom 0.7: R23.1 27.65,26.5 S4.+
N$26
  Bottom 0.5: M1.31 38.73,85 C11.1
N$27
  Bottom 0.5: C14.1 64.13,85.02 M1.21
N$28
  Bottom 0.5: C15.1 61.59,85.06 M1.22
N$29
  Bottom 0.5: M1.23 59.05,85.1 C16.1
N$30
  Bottom 0.5: M1.24 C17.1
N$31
  Bottom 0.5: M1.25 53.97,85.12 C18.1
N$32
  Bottom 0.5: M1.32 36.19,84.66 C19.1
N$33
  Bottom 1.2: R26.1 R27.2
N$34  (via drill 0.35)
  Top 0.3: v53.2,53.9 v51.5,55.6
  Bottom 0.3: R24.1 50.6,56.5 v51.5,55.6 | v53.2,53.9 54.91,52.19 IC2.8
N$35
  Bottom 1.2: R27.1 29.5,38 26.5,35 21.54,35 20.95,34.41 M1.3
N$36
  Bottom 1.2: M1.2 18.41,35.41 20,37 25.5,37 26.5,38 R30.1
N$37
  Bottom 1.2: R33.1 22.92,39 19,39 15.87,35.87 M1.1
N$38
  Bottom 1.2: R29.1 R30.2
N$39
  Bottom 1.2: R32.1 R33.2
PB_FWD
  Bottom 0.3: R10.2 33.85,34 30,34 23.6,27.6 Q1.1
PB_MENU
  Bottom 0.3: R13.2 40.5,28.35 Q4.1
PB_REV
  Bottom 0.3: R11.2 29.65,35.65 22.5,28.5 22.5,22.5 24.5,20.5 24.5,12.35 Q2.1
PB_STOP  (via drill 0.35)
  Top 0.3: v40,20.5 v40,17.5
  Bottom 0.3: R12.2 38,31 38.5,30.5 38.5,23.5 40,22 v40,20.5 | v40,17.5 40,11.85 Q3.1
REV
  Bottom 0.3: C7.1 19.15,5.35 21,3.5 39.5,3.5 49.5,13.5 49.5,41.5 47.13,43.87 IC1.5
  Bottom 0.5: S2.2A S2.2B 19.15,7.35 C7.1 R9.1
SCL
  Bottom 0.3: IC1.14 33.59,46.41 30,50 27,50 24,53 24,63 20.5,66.5 16.5,66.5 15.11,67.89 X1.4
SDA
  Bottom 0.3: IC1.15 34.33,47.67 30.5,51.5 27.5,51.5 25,54 25,63.5 20.61,67.89 X1.3
STOP
  Bottom 0.3: C6.1 35.15,4.85 35.5,4.5 39,4.5 48.5,14 48.5,41 46.91,42.59 IC1.6
  Bottom 0.5: S3.2A 34.5,7.96 | 34.5,7.96 S3.2B | R14.1 C6.1 35.15,7.31 34.5,7.96
UART_RX
  Bottom 0.3: X1.11 15.54,56.5 12.5,56.5 11.5,55.5 X2.2
UART_TX
  Bottom 0.3: X2.3 14,57.5 X1.12

### Text on the board
Top: TOP | RevA
Bottom: BOT
tPlace: Mini VFD | ADAM+ | FWD | MENU | REV | STOP
bPlace: +3.3V | GND | UART